# EAGLE design Frank (EAGLE 9.5.1)
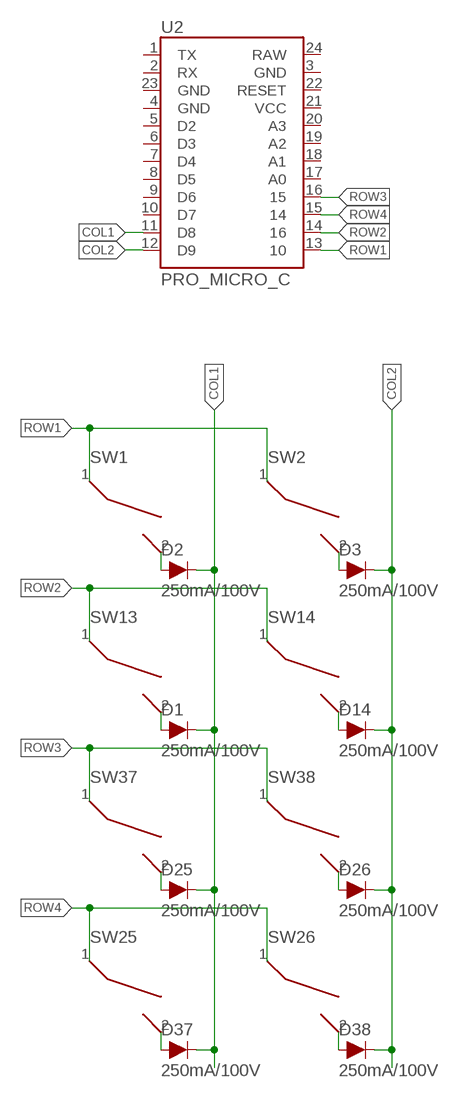
[diagram p0: schematic, sheet 1]

## Parts
D1  250mA/100V  DIODE-BAS16J  [SOD-323]
D2  250mA/100V  DIODE-BAS16J  [SOD-323]
D3  250mA/100V  DIODE-BAS16J  [SOD-323]
D14  250mA/100V  DIODE-BAS16J  [SOD-323]
D25  250mA/100V  DIODE-BAS16J  [SOD-323]
D26  250mA/100V  DIODE-BAS16J  [SOD-323]
D37  250mA/100V  DIODE-BAS16J  [SOD-323]
D38  250mA/100V  DIODE-BAS16J  [SOD-323]
SW1  CHERRY_MX_WITH_FIXING_PINS  [MX1A-XXNW]
SW2  CHERRY_MX_WITH_FIXING_PINS  [MX1A-XXNW]
SW13  CHERRY_MX_WITH_FIXING_PINS  [MX1A-XXNW]
SW14  CHERRY_MX_WITH_FIXING_PINS  [MX1A-XXNW]
SW25  CHERRY_MX_WITH_FIXING_PINS  [MX1A-XXNW]
SW26  CHERRY_MX_WITH_FIXING_PINS  [MX1A-XXNW]
SW37  CHERRY_MX_WITH_FIXING_PINS  [MX1A-XXNW]
SW38  CHERRY_MX_WITH_FIXING_PINS  [MX1A-XXNW]
U2  PRO_MICRO_C  [PRO_MICRO_C]

## Nets
COL1: D1.C D2.C D25.C D37.C U2.11(D8)
COL2: D3.C D14.C D26.C D38.C U2.12(D9)
N$1: D2.A SW1.2
N$2: D3.A SW2.2
N$13: D1.A SW13.2
N$14: D25.A SW37.2
N$15: D37.A SW25.2
N$16: D38.A SW26.2
N$17: D26.A SW38.2
N$18: D14.A SW14.2
ROW1: SW1.1 SW2.1 U2.13
ROW2: SW13.1 SW14.1 U2.14
ROW3: SW37.1 SW38.1 U2.16
ROW4: SW25.1 SW26.1 U2.15
Unconnected: U2.1(TX) U2.2(RX) U2.3(GND) U2.4(GND) U2.5(D2) U2.6(D3) U2.7(D4) U2.8(D5) U2.9(D6) U2.10(D7) U2.17(A0) U2.18(A1) U2.19(A2) U2.20(A3) U2.21(VCC) U2.22(RESET) U2.23(GND) U2.24(RAW)

## Library data of the parts
D1-D3 D14 D25 D26 D37 D38 = SparkFun-DiscreteSemi:DIODE: Diode These are standard reverse protection diodes and small signal diodes. SparkFun Products: SparkFun SparkPunk Sound Kit <https://www.sparkfun.com/products/11177> SparkFun ESP8266 Thing <https://www.sparkfun.com/products/13231>; PROD_ID: DIO-09646
SW1 SW2 SW13 SW14 SW25 SW26 SW37 SW38 = Cherry_MX_v7.0:CHERRY_MX
U2 = Castellated:PRO_MICRO_C

## Board
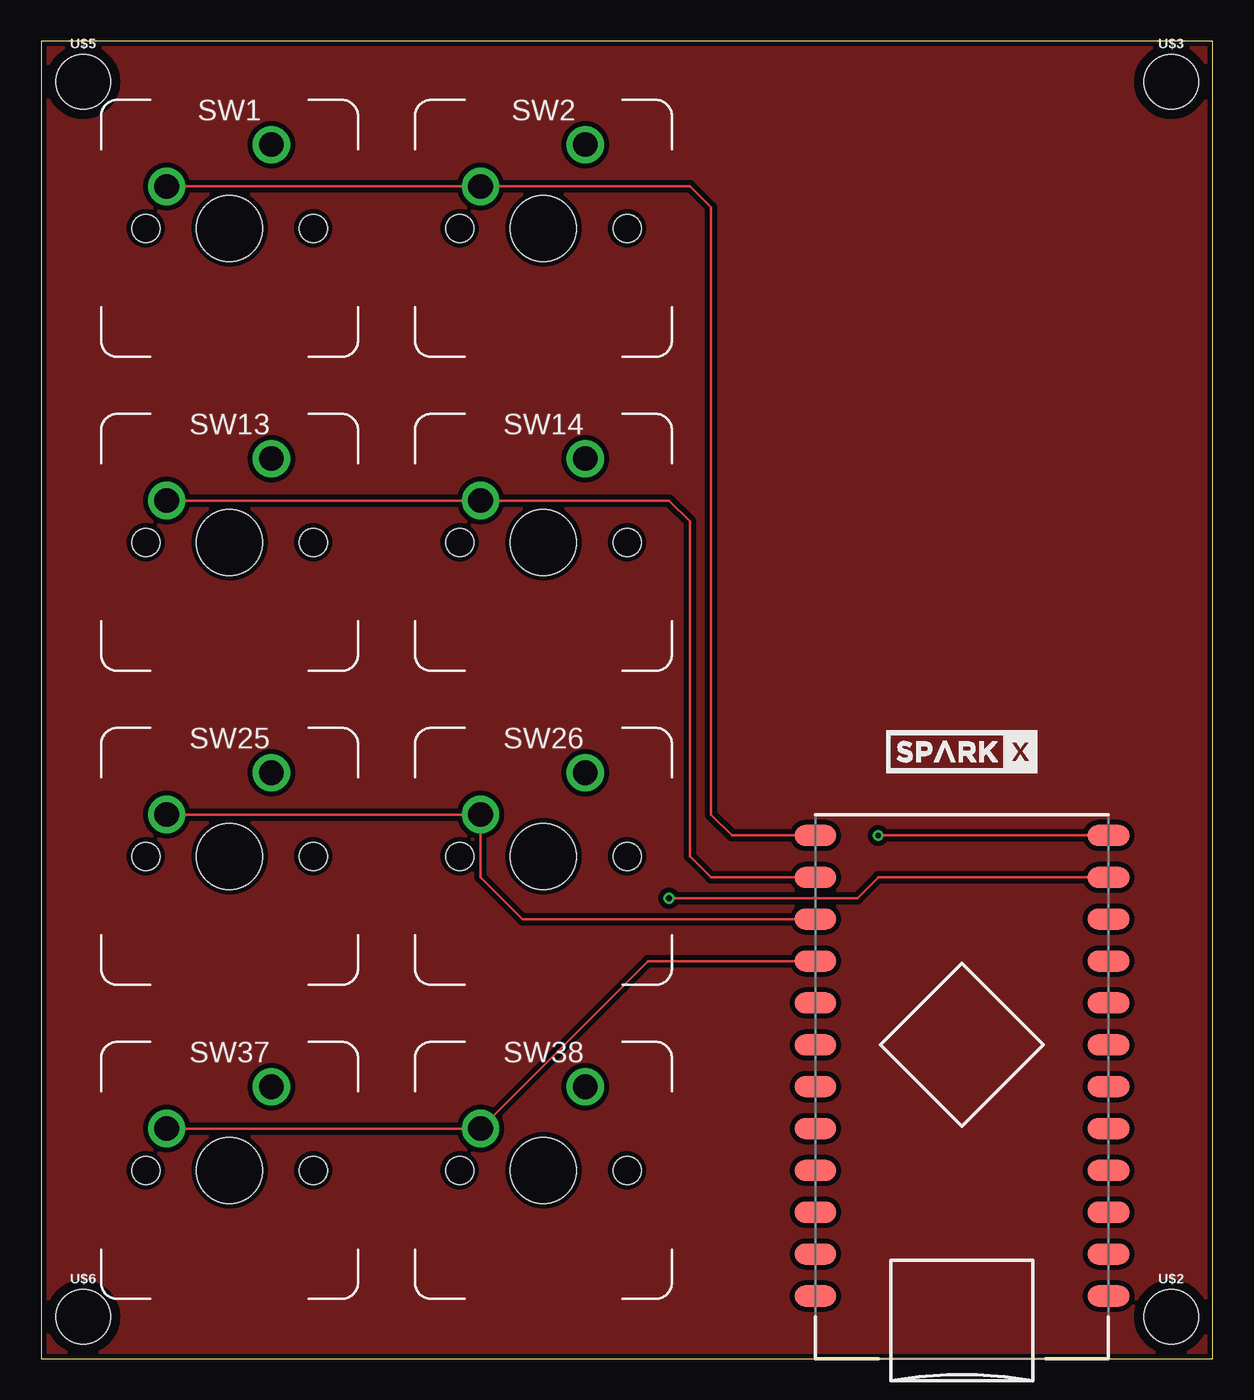
[diagram p1: board, top side]
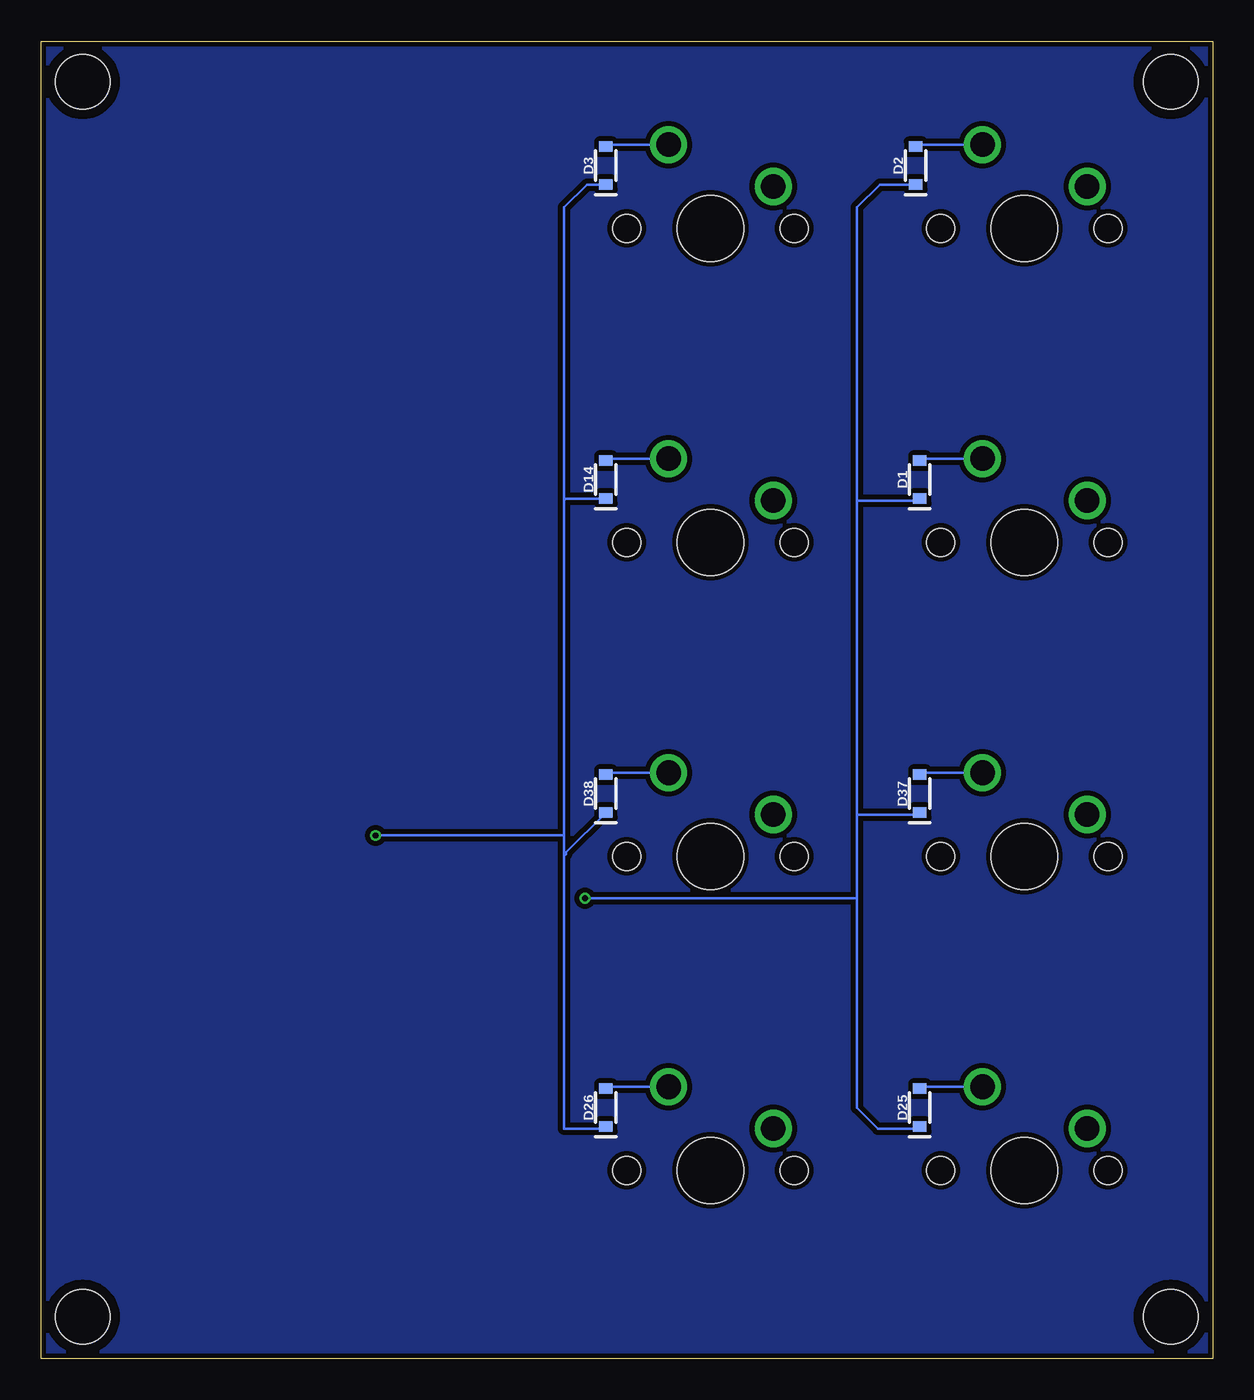
[diagram p2: board, bottom side, seen from below]

Size 71.1 x 79.93 mm. Coordinates in mm from the lower left corner, seen from the top.
Outline: 0,0 71.1,0 71.1,79.93 0,79.93 0,0
Copper layers (1*16): Top 0.035mm / dielectric 1.5mm / Bottom 0.035mm
Design rules "SparkFun-2-layer-PCBWay-LIMIT": minimum track width 6mil, minimum drill 0.3mm, track to track 6mil, track to pad 6mil, pad to pad 6mil, via to via 6mil, smd to smd 6mil, copper to edge 6mil, drill to drill 6mil, minimum pad ring 6mil, minimum via ring 6mil, stop-mask expansion 4mil, vias tented up to drill 25mil, thermal gap 10mil

### Footprints (pad centres in the part's own frame; a part is rotated, then mirrored left to right if it is on the bottom)
SOD-323 = smd 0.63 x 0.83: A 1.15,0; C -1.15,0
MX1A-XXNW = drill 1.5: 1 -3.81,2.54; 2 2.54,5.08 | hole 4: 0,0 | hole 1.7: -5.08,0; 5.08,0
PRO_MICRO_C = smd 2.54 x 1.27: 1 -8.89,12.7; 2 -8.89,10.16; 3 -8.89,7.62; 4 -8.89,5.08; 5 -8.89,2.54; 6 -8.89,0; 7 -8.89,-2.54; 8 -8.89,-5.08; 9 -8.89,-7.62; 10 -8.89,-10.16; 11 -8.89,-12.7; 12 -8.89,-15.24; 13 8.89,-15.24; 14 8.89,-12.7; 15 8.89,-10.16; 16 8.89,-7.62; 17 8.89,-5.08; 18 8.89,-2.54; 19 8.89,0; 20 8.89,2.54; 21 8.89,5.08; 22 8.89,7.62; 23 8.89,10.16; 24 8.89,12.7
STAND-OFF = hole 3.302: 0,0

### Placement (x,y rotation side)
D1  17.78,53.34 90 bottom
D2  18.03,72.39 90 bottom
D3  36.83,72.39 90 bottom
D14  36.83,53.34 90 bottom
D25  17.78,15.24 90 bottom
D26  36.83,15.24 90 bottom
D37  17.78,34.29 90 bottom
D38  36.83,34.29 90 bottom
SW1  11.43,68.58 0 top
SW2  30.48,68.58 0 top
SW13  11.43,49.53 0 top
SW14  30.48,49.53 0 top
SW25  11.43,30.48 0 top
SW26  30.48,30.48 0 top
SW37  11.43,11.43 0 top
SW38  30.48,11.43 0 top
U2  55.88,16.51 180 top
U$2  [STAND-OFF]  68.58,2.54 0 top
U$3  [STAND-OFF]  68.58,77.47 0 top
U$5  [STAND-OFF]  2.54,77.47 0 top
U$6  [STAND-OFF]  2.54,2.54 0 top
U$7  [SPARKX-MEDIUM]  55.88,36.83 0 top

### Tracks (layer width: path | path; a pad name or v marks a point on that pad's centre or on a via)
COL1  (via drill 0.35)
  Top 0.152: U2.11 50.8,29.21 49.53,27.94 v38.1,27.94
  Bottom 0.152: D25.C 17.9,13.97 20.32,13.97 21.59,15.24 21.59,27.94 | D2.C 20.2,71.24 21.59,69.85 21.59,52.07 | 21.59,52.07 17.9,52.07 D1.C | D37.C 17.9,33.02 21.59,33.02 | 21.59,33.02 21.59,52.07 | 21.59,27.94 21.59,33.02 | v38.1,27.94 21.59,27.94
COL2  (via drill 0.35)
  Top 0.152: U2.12 v50.8,31.75
  Bottom 0.152: D3.C 37.98,71.24 39.37,69.85 39.37,52.07 | 39.37,52.07 39.37,31.75 | 39.37,31.75 39.37,30.48 | 39.37,30.48 39.37,13.97 36.95,13.97 D26.C | D38.C 39.25,30.72 39.25,30.6 39.37,30.48 | D14.C 39.25,52.19 39.37,52.07 | v50.8,31.75 39.37,31.75
GND
  pour Top (isolate 0.305): 0,0 0,80.01 71.12,80.01 71.12,0
  pour Bottom (isolate 0.305): 0,0 71.12,0 71.12,80.01 0,80.01
N$1
  Bottom 0.152: SW1.2 17.91,73.66 D2.A
N$2
  Bottom 0.152: SW2.2 36.71,73.66 D3.A
N$13
  Bottom 0.152: SW13.2 17.66,54.61 D1.A
N$14
  Bottom 0.152: SW37.2 17.66,16.51 D25.A
N$15
  Bottom 0.152: SW25.2 17.66,35.56 D37.A
N$16
  Bottom 0.152: SW26.2 36.71,35.56 D38.A
N$17
  Bottom 0.152: SW38.2 36.71,16.51 D26.A
N$18
  Bottom 0.152: SW14.2 36.71,54.61 D14.A
ROW1
  Top 0.152: SW1.1 SW2.1 39.37,71.12 40.64,69.85 40.64,33.02 41.91,31.75 U2.13
ROW2
  Top 0.152: SW13.1 SW14.1 38.1,52.07 39.37,50.8 39.37,30.48 40.64,29.21 U2.14
ROW3
  Top 0.152: SW37.1 SW38.1 36.83,24.13 U2.16
ROW4
  Top 0.152: SW25.1 SW26.1 26.67,29.21 29.21,26.67 U2.15